# EAGLE design FXLoader_rev_A (EAGLE 9.6.2)
PC Engine Joypad Breakout Version 1.0
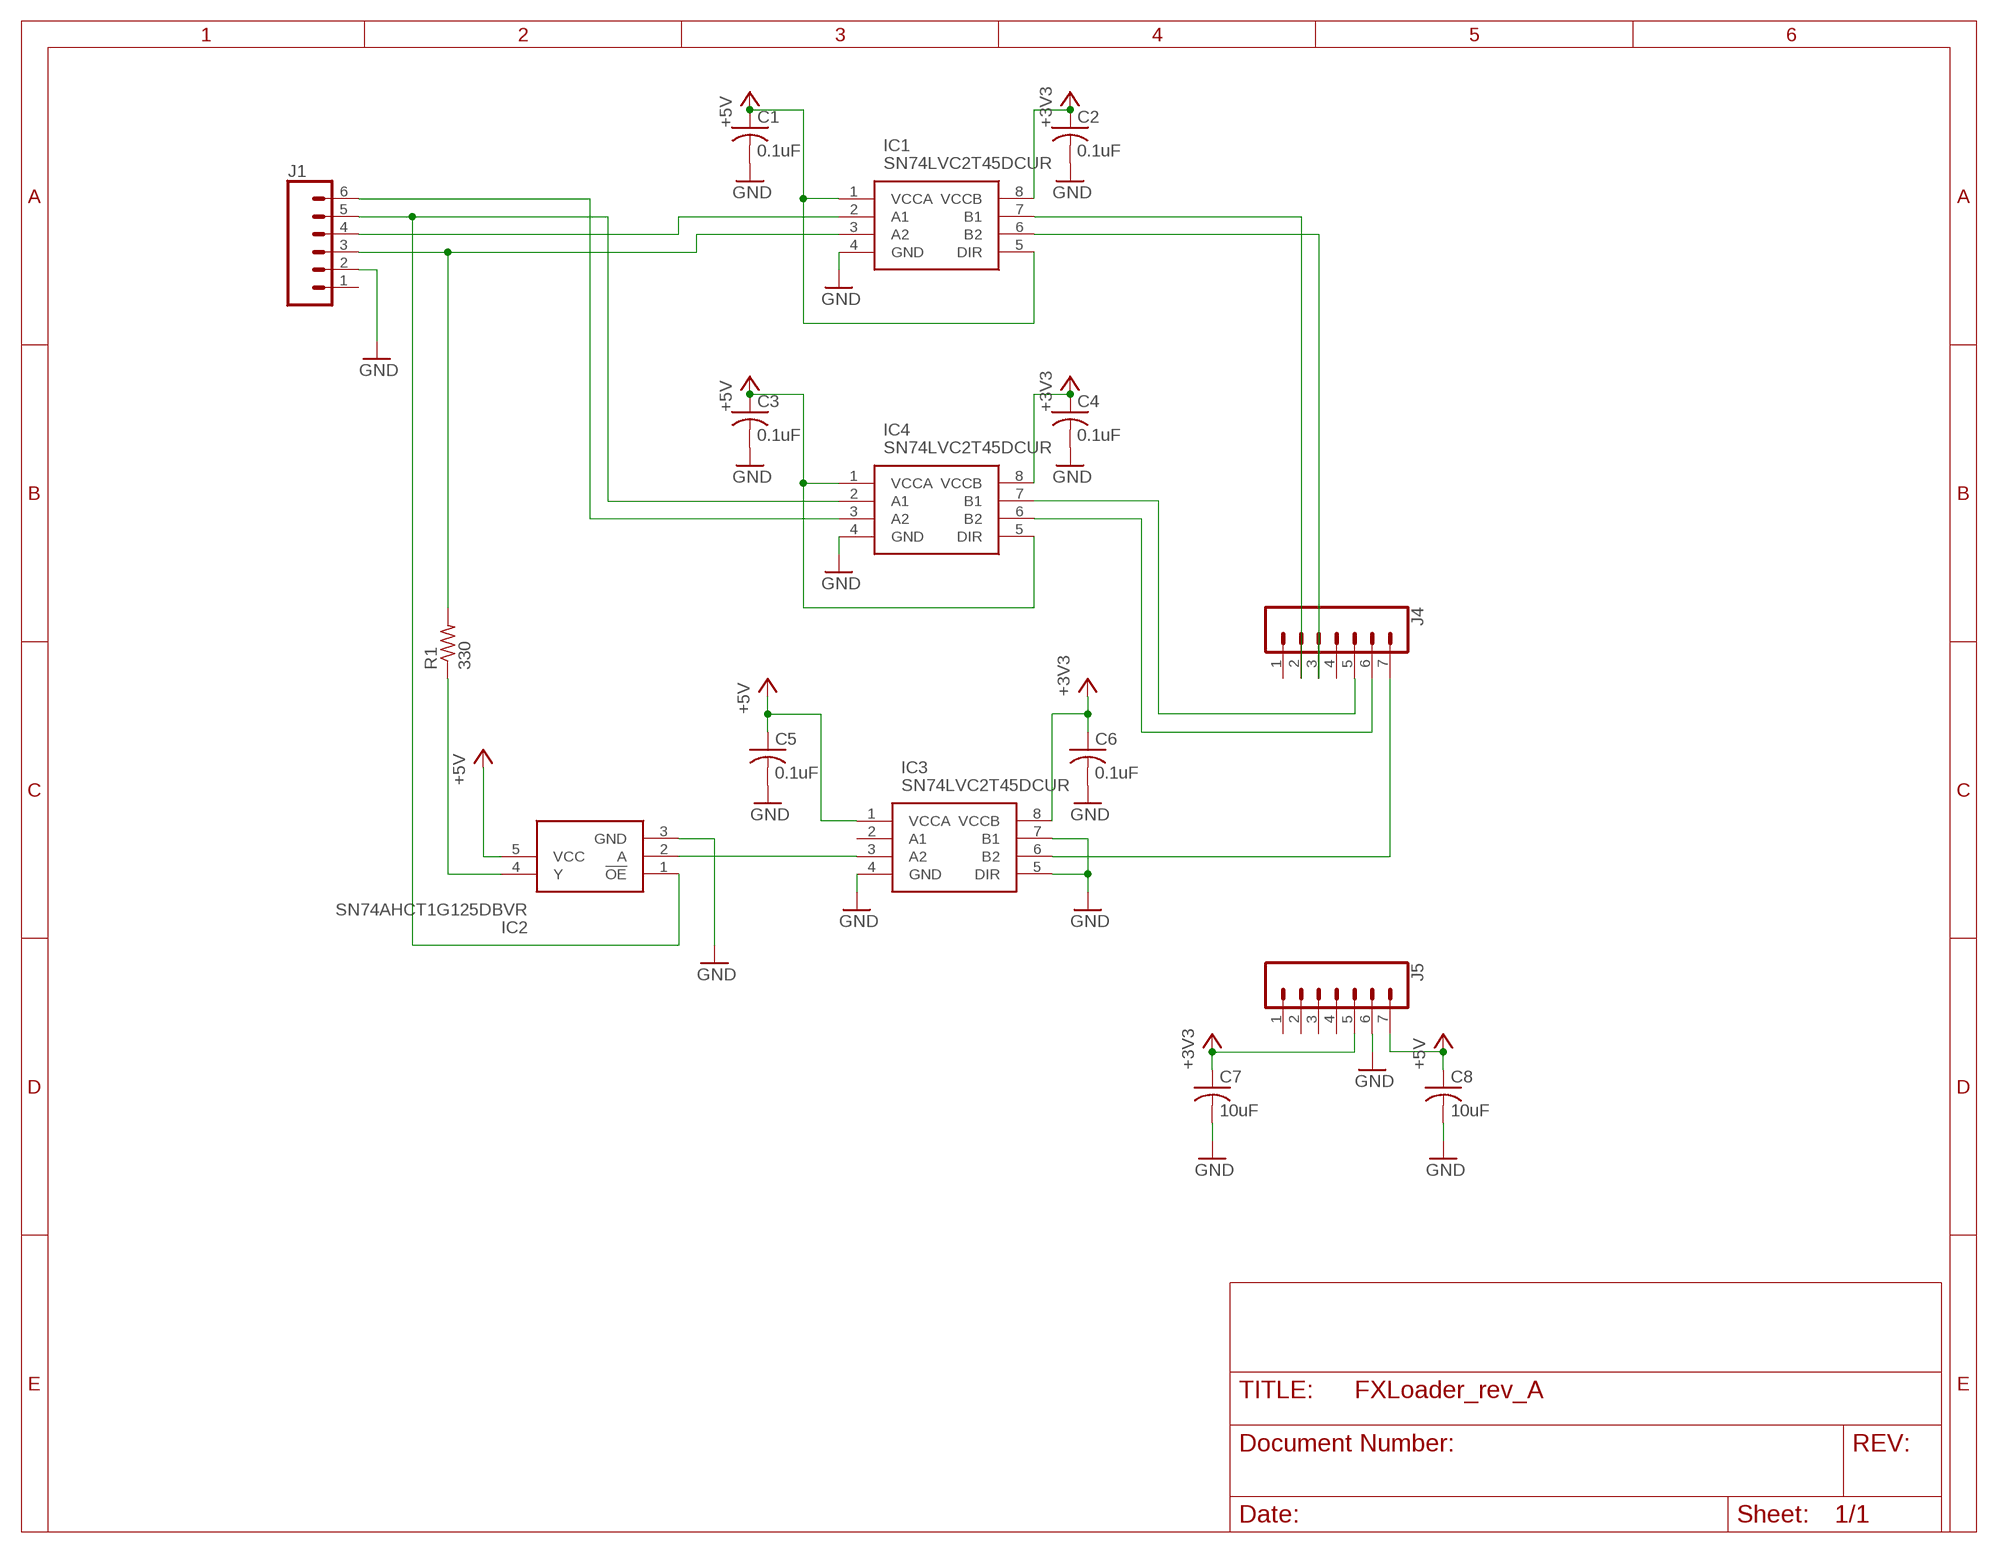
[diagram p0: schematic, sheet 1]

## Parts
C1  0.1uF  C-USC0402  [C0402]
C2  0.1uF  C-USC0402  [C0402]
C3  0.1uF  C-USC0402  [C0402]
C4  0.1uF  C-USC0402  [C0402]
C5  0.1uF  C-USC0402  [C0402]
C6  0.1uF  C-USC0402  [C0402]
C7  10uF  C-USC0805  [C0805]
C8  10uF  C-USC0805  [C0805]
IC1  SN74LVC2T45DCUR  [SOP50P310X90-8N]
IC2  SN74AHCT1G125DBVR  [SOT95P280X145-5N]
IC3  SN74LVC2T45DCUR  [SOP50P310X90-8N]
IC4  SN74LVC2T45DCUR  [SOP50P310X90-8N]
J1  CONN_06NO_SILK_FEMALE_PTH  [1X06_NO_SILK]
J4  CONN_071X07_LONGPADS_OFFSET_B  [1X07_LONGPADS_OFFSET_B]
J5  CONN_071X07_LONGPADS_OFFSET  [1X07_LONGPADS_OFFSET]
R1  330  R-US_R0402  [R0402]

## Nets
+3V3 [power]: C2.1 C4.1 C6.1 C7.1 IC1.8(VCCB) IC3.8(VCCB) IC4.8(VCCB) J5.5
+5V [power]: C1.1 C3.1 C5.1 C8.1 IC1.1(VCCA) IC1.5(DIR) IC2.5(VCC) IC3.1(VCCA) IC4.1(VCCA) IC4.5(DIR) J5.7
CLK: IC1.2(A1) J1.4
DATA: IC1.3(A2) J1.3 R1.2
GND: C1.2 C2.2 C3.2 C4.2 C5.2 C6.2 C7.2 C8.2 IC1.4(GND) IC2.3(GND) IC3.4(GND) IC3.5(DIR) IC3.7(B1) IC4.4(GND) J1.2 J5.6
N$1: IC2.2(A) IC3.3(A2)
N$2: IC1.7(B1) J4.2
N$3: IC3.6(B2) J4.7
N$4: IC2.4(Y) R1.1
N$5: IC4.3(A2) J1.6
N$6: IC4.6(B2) J4.6
N$7: IC1.6(B2) J4.3
N$8: IC4.7(B1) J4.5
W/R: IC2.1(!OE) IC4.2(A1) J1.5
Unconnected: IC3.2(A1) J1.1 J4.1 J4.4 J5.1 J5.2 J5.3 J5.4

## Library data of the parts
C1-C8 = resistor:C-US: CAPACITOR, American symbol
IC1 IC3 IC4 = PC-Engine:SN74LVC2T45DCUR: Texas Instruments SN74LVC2T45DCUR, Voltage Level Translator, Bus Transceiver, 3-State, 1.65 5.5 V, 8-Pin UM Source: Datasheet <http://www.ti.com/lit/gpn/sn74lvc2t45>; ARROW_PART_NUMBER: SN74LVC2T45DCUR; ARROW_PRICE-STOCK: https://www.arrow.com/en/products/sn74lvc2t45dcur/texas-instruments?region=nac; DESCRIPTION: Texas Instruments SN74LVC2T45DCUR, Voltage Level Translator, Bus Transceiver, 3-State, 1.65 5.5 V, 8-Pin UM; HEIGHT: 0.9mm; MANUFACTURER_NAME: Texas Instruments; MANUFACTURER_PART_NUMBER: SN74LVC2T45DCUR; MOUSER_PART_NUMBER: 595-SN74LVC2T45DCUR; MOUSER_PRICE-STOCK: https://www.mouser.co.uk/ProductDetail/Texas-Instruments/SN74LVC2T45DCUR?qs=0smPjiIwnfIdG9vxyJHBdA%3D%3D
IC2 = PC-Engine:SN74AHCT1G125DBVR: 74AHCT Single Tri-state Bus Buffer SOT23 SN74AHCT1G125DBVR, Bus Buffer, HCT, 8.5 ns@ 50 pF, 8mA 4.5 ??? 5.5 V 5-Pin SOT-23 Source: Datasheet <http://www.ti.com/lit/ds/symlink/sn74ahct1g125.pdf>; ARROW_PART_NUMBER: SN74AHCT1G125DBVR; ARROW_PRICE-STOCK: https://www.arrow.com/en/products/sn74ahct1g125dbvr/texas-instruments?region=nac; DESCRIPTION: 74AHCT Single Tri-state Bus Buffer SOT23 SN74AHCT1G125DBVR, Bus Buffer, HCT, 8.5 ns@ 50 pF, 8mA 4.5 ??? 5.5 V 5-Pin SOT-23; HEIGHT: 1.45mm; MANUFACTURER_NAME: Texas Instruments; MANUFACTURER_PART_NUMBER: SN74AHCT1G125DBVR; MOUSER_PART_NUMBER: 595-SNAHCT1G125DBVR; MOUSER_PRICE-STOCK: https://www.mouser.co.uk/ProductDetail/Texas-Instruments/SN74AHCT1G125DBVR?qs=N6WZOzgtpqVaVW8Lh%252BgevA%3D%3D
J1 = SparkFun-Connectors:CONN_06: Multi connection point. Often used as Generic Header-pin footprint for 0.1 inch spaced/style header connections On any of the 0.1 inch spaced packages, you can populate with these: Break Away Headers - Straight <https://www.sparkfun.com/products/116> (PRT-00116) Break Away Male Headers - Right Angle <https://www.sparkfun.com/products/553> (PRT-00553) Female Headers <https://www.sparkfun.com/products/115> (PRT-00115) Break Away Headers - Machine Pin <https://www.sparkfun.com/products/117> (PRT-00117) Break Away Female Headers - Swiss Machine Pin <https://www.sparkfun.com/products/743> (PRT-00743) Arduino Stackable Header - 6 Pin <https://www.sparkfun.com/products/9280> (PRT-09280) For SCREWTERMINALS and SPRING TERMINALS visit here: Screw Terimnals on SparkFun.com <https://www.sparkfun.com/search/results?term=Screw+Terminals> (5mm/3.5mm/2.54mm spacing) This device is also useful as a general connection point to wire up your design to another part of your project. Our various solder wires solder well into these plated through hole pads. Hook-Up Wire - Assortment (Stranded, 22 AWG) <https://www.sparkfun.com/products/11375> (PRT-11375) Hook-Up Wire - Assortment (Solid Core, 22 AWG) <https://www.sparkfun.com/products/11367> (PRT-11367) View the entire wire category on our website here <https://www.sparkfun.com/categories/141>; PROD_ID: CONN-08437
J4 J5 = SparkFun-Connectors_new:CONN_07: Multi connection point. Often used as Generic Header-pin footprint for 0.1 inch spaced/style header connections On any of the 0.1 inch spaced packages, you can populate with these: Break Away Headers - Straight <https://www.sparkfun.com/products/116> (PRT-00116) Break Away Male Headers - Right Angle <https://www.sparkfun.com/products/553> (PRT-00553) Female Headers <https://www.sparkfun.com/products/115> (PRT-00115) Break Away Headers - Machine Pin <https://www.sparkfun.com/products/117> (PRT-00117) Break Away Female Headers - Swiss Machine Pin <https://www.sparkfun.com/products/743> (PRT-00743) For SCREWTERMINALS and SPRING TERMINALS visit here: Screw Terimnals on SparkFun.com <https://www.sparkfun.com/search/results?term=Screw+Terminals> (5mm/3.5mm/2.54mm spacing) This device is also useful as a general connection point to wire up your design to another part of your project. Our various solder wires solder well into these plated through hole pads. Hook-Up Wire - Assortment (Stranded, 22 AWG) <https://www.sparkfun.com/products/11375> (PRT-11375) Hook-Up Wire - Assortment (Solid Core, 22 AWG) <https://www.sparkfun.com/products/11367> (PRT-11367) View the entire wire category on our website here <https://www.sparkfun.com/categories/141> Special notes: Molex polarized connector foot print use with SKU : PRT-08231 with associated crimp pins and housings. 1MM SMD Version SKU: PRT-10208 NOTES ON THE VARIANTS LOCK and LOCK_LONGPADS... This footprint was designed to help hold the alignment of a through-hole component (i.e. 6-pin header) while soldering it into place. You may notice that each hole has been shifted either up or down by 0.005 of an inch from it's more standard position (which is a perfectly straight line). This slight alteration caused the pins (the squares in the middle) to touch the edges of the holes. Because they are alternating, it causes a "brace" to hold the component in place. 0.005 has proven to be the perfect amount of "off-center" position when using our standard breakaway headers. Although looks a little odd when you look at the bare footprint, once you have a header in there, the alteration is very hard to notice. Also,if you push a header all the way into place, it is covered up entirely on the bottom side.
R1 = resistor:R-US_: RESISTOR, American symbol

## Net classes
0 default: width 0.152 mm, drill 0.356 mm, clearance 0.152 mm
1 power: width 0.305 mm, drill 0.356 mm, clearance 0.152 mm
2 signal: width 0.152 mm, drill 0.356 mm, clearance 0.152 mm

## Board
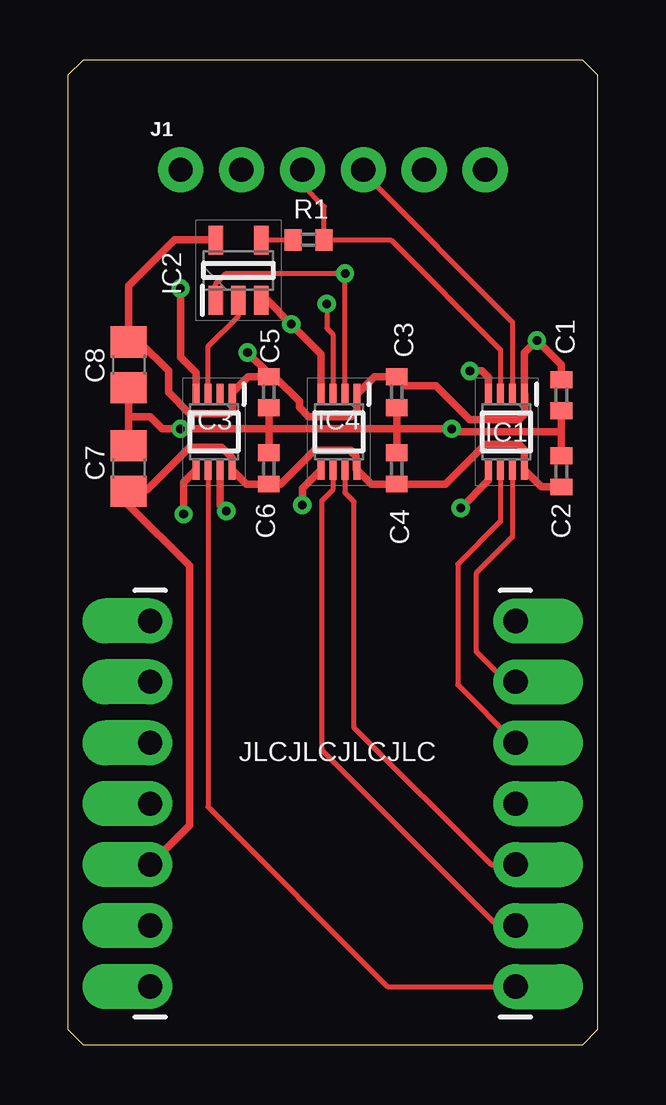
[diagram p1: board, top side]
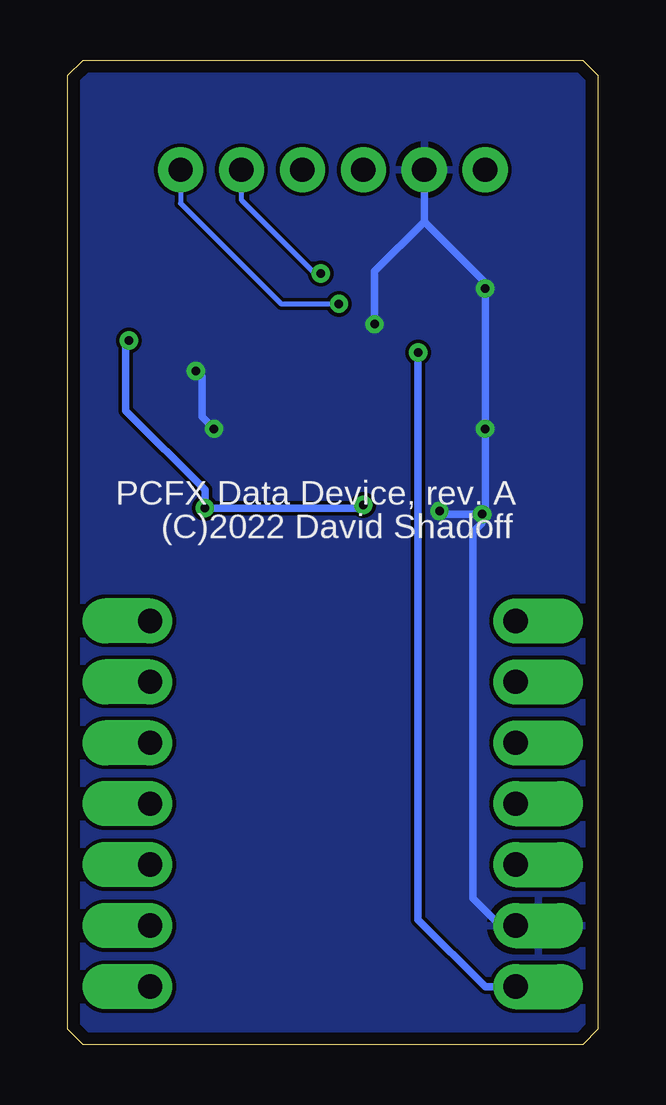
[diagram p2: board, bottom side, seen from below]

Size 22.1 x 41.02 mm. Coordinates in mm from the lower left corner, seen from the top.
Outline: 0,40.39 0,0.64 0.64,0 21.46,0 22.1,0.64 22.1,40.39 21.46,41.02 0.64,41.02 0,40.39
Copper layers (1*16): Top 0.035mm / dielectric 1.5mm / Bottom 0.035mm
Design rules "default *": minimum track width 6mil, minimum drill 0.35mm, track to track 6mil, track to pad 6mil, pad to pad 6mil, via to via 6mil, smd to smd 6mil, copper to edge 20mil, drill to drill 6mil, minimum pad ring 10mil, minimum via ring 8mil, stop-mask expansion 3mil, vias tented up to drill 18mil, thermal gap 10mil

### Footprints (pad centres in the part's own frame; a part is rotated, then mirrored left to right if it is on the bottom)
C0402 = smd 0.7 x 0.9: 1 -0.65,0; 2 0.65,0
C0805 = smd 1.3 x 1.5: 1 -0.95,0; 2 0.95,0
SOP50P310X90-8N = smd 0.85 x 0.3: 1 -1.575,0.75; 2 -1.575,0.25; 3 -1.575,-0.25; 4 -1.575,-0.75; 5 1.575,-0.75; 6 1.575,-0.25; 7 1.575,0.25; 8 1.575,0.75
SOT95P280X145-5N = smd 1.2 x 0.6: 1 -1.25,0.95; 2 -1.25,0; 3 -1.25,-0.95; 4 1.25,-0.95; 5 1.25,0.95
1X06_NO_SILK = drill 1.016 pad 1.88: 1 0,0; 2 2.54,0; 3 5.08,0; 4 7.62,0; 5 10.16,0; 6 12.7,0
1X07_LONGPADS_OFFSET_B = drill 1.016 pad 1.88 offset: 1 0,0; 2 2.54,0; 3 5.08,0; 4 7.62,0; 5 10.16,0; 6 12.7,0; 7 15.24,0
1X07_LONGPADS_OFFSET = drill 1.016 pad 1.88 offset: 1 0,0; 2 2.54,0; 3 5.08,0; 4 7.62,0; 5 10.16,0; 6 12.7,0; 7 15.24,0
R0402 = smd 0.7 x 0.9: 1 -0.65,0; 2 0.65,0

### Placement (x,y rotation side)
C1  20.57,27.05 270 top
C2  20.57,23.88 90 top
C3  13.72,27.18 270 top
C4  13.72,24 90 top
C5  8.38,27.18 270 top
C6  8.38,24 90 top
C7  2.54,24 90 top
C8  2.54,28.32 270 top
IC1  18.29,25.53 270 top
IC2  7.11,32.26 90 top
IC3  6.1,25.53 270 top
IC4  11.3,25.53 270 top
J1  4.7,36.45 0 top
J4  18.67,17.65 270 top
J5  3.43,17.65 270 top
R1  10.03,33.53 0 top

### Tracks (layer width: path | path; a pad name or v marks a point on that pad's centre or on a via)
+3V3
  Top 0.305: C2.1 19.75,23.24 IC1.8 19.04,24.78 18.8,25.02 17.41,25.02 15.75,23.35 C4.1 12.65,23.35 IC4.8 12.01,24 12.01,24.5 11.81,24.7 11.81,24.77 10.29,24.77 8.88,23.35 C6.1 7.45,23.35 IC3.8 6.85,24.46 6.41,24.89 5.08,24.89 3.3,23.11 2.6,23.11 C7.1 2.54,22.48 5.08,19.94 5.08,9.14 J5.5
+5V  (via drill 0.36)
  Top 0.305: C5.1 7.51,27.83 6.85,27.17 IC3.1 6.86,26.42 6.73,26.29 5.08,26.29 4.19,27.18 4.19,28.07 2.99,29.27 C8.1 2.54,31.62 4.45,33.53 6.14,33.53 IC2.5 | IC1.5 17.54,23.51 v16.38,22.35 | C1.1 20.57,28.32 v19.56,29.34 19.04,28.82 IC1.1 19.05,26.29 18.8,26.04 16.76,26.04 15.35,27.45 14.1,27.45 C3.1 12.78,27.83 IC4.1 12.05,26.4 11.81,26.16 10.03,26.16 9.65,26.54 9.65,26.8 8.62,27.83 C5.1 | IC4.5 9.78,23.18 v9.78,22.48 | C5.1 8.38,27.94 v7.49,28.83
  Bottom 0.305: v19.56,29.34 19.68,29.21 19.68,26.42 16.38,23.11 v16.38,22.35 9.91,22.35 v9.78,22.48 | v7.49,28.83 7.49,5.21 4.7,2.41 J5.7
CLK
  Top 0.203: J1.4 12.32,36.32 18.54,30.1 IC1.2
DATA
  Top 0.203: IC1.3 18.04,28.95 13.46,33.53 R1.2 10.68,34.91 9.78,35.81 J1.3
GND  (via drill 0.36)
  Top 0.305: C8.2 2.54,26.16 | 2.54,26.16 C7.2 | C5.2 8.38,25.65 | C6.2 8.38,25.65 | C1.2 20.57,25.53 | 20.57,25.53 C2.2 | 2.54,26.16 3.43,26.16 3.94,25.65 v4.7,25.65 8.38,25.65 | 20.57,25.53 16.13,25.53 v16,25.65 13.72,25.65 | IC3.4 5.35,27.99 4.7,28.64 v4.7,31.5 | v4.83,22.1 4.83,23.43 IC3.5 | IC3.7 6.35,22.48 v6.6,22.23 | v16.76,28.07 17.27,28.07 17.54,27.8 IC1.4 | 13.72,25.65 8.38,25.65 | 13.72,25.65 C3.2 | 13.72,25.65 C4.2 | IC2.3 8.32,31.01 v9.31,30.01 10.55,28.77 IC4.4
  Bottom 0.305: J1.2 7.24,34.29 | 7.24,34.29 4.7,31.75 v4.7,31.5 v4.7,25.65 4.7,22.23 v4.83,22.1 | v4.83,22.1 4.83,21.72 5.21,21.34 5.21,6.1 4.06,4.95 J5.6 | v4.83,22.1 6.48,22.1 v6.6,22.23 | v16,25.65 16.51,26.16 16.51,27.81 v16.76,28.07 | 7.24,34.29 9.31,32.22 v9.31,30.01
  pour Bottom: -0.64,-0.51 -0.64,41.53 22.86,41.53 22.86,-0.51
N$1
  Top 0.203: IC3.3 5.85,29.09 7.11,30.35 IC2.2
N$2
  Top 0.152: 18.28,15.11 18.29,15.11
  Top 0.203: IC1.7 18.54,21.16 17.01,19.63 17.01,16.38 18.28,15.11 | 18.29,15.11 J4.2
N$3
  Top 0.203: IC3.6 5.85,9.9 13.34,2.41 J4.7
N$4
  Top 0.203: IC2.4 8.08,33.53 R1.1
N$5  (via drill 0.36)
  Top 0.203: v10.79,30.86 10.79,29.84 11.05,29.59 IC4.3
  Bottom 0.203: J1.6 17.4,35.05 13.21,30.86 v10.79,30.86
N$6
  Top 0.203: IC4.6 11.05,23.12 10.59,22.66 10.59,12.27 17.91,4.95 J4.6
N$7
  Top 0.152: J4.3
  Top 0.203: IC1.6 18.04,21.79 16.26,20.02 16.26,14.99 J4.3
N$8
  Top 0.203: IC4.7 11.55,22.99 11.87,22.67 11.94,22.61 11.94,13.21 17.65,7.49 J4.5
W/R  (via drill 0.36)
  Top 0.203: IC2.1 6.16,31.69 6.6,32.13 v11.56,32.13 IC4.2
  Bottom 0.203: v11.56,32.13 11.81,32.13 14.86,35.18 J1.5

### Text on the board
tNames: JLCJLCJLCJLC
bNames: PCFX Data Device, rev. A | (C)2022 David Shadoff